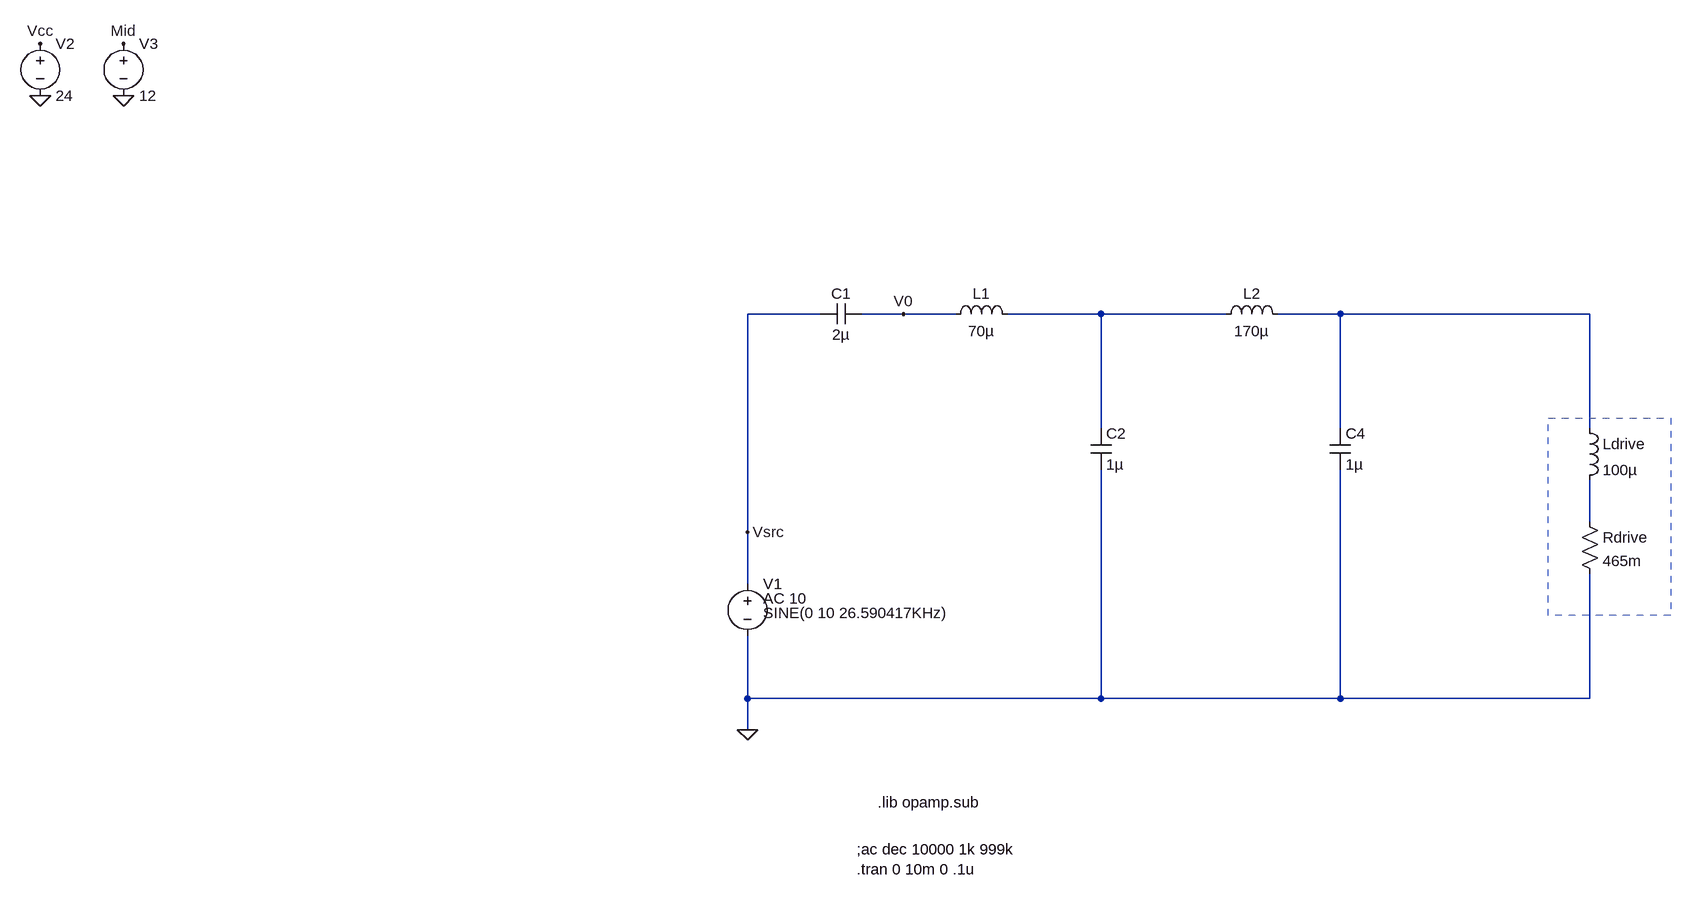
[diagram p0: schematic Tx_Filter_MPSv2_v2-WithOpAmp.asc]
Tx_Filter_MPSv2_v2-WithOpAmp.asc, the LTspice schematic file:
Version 4
SHEET 1 2128 1188
WIRE 656 64 544 64
WIRE 784 64 720 64
WIRE 864 64 784 64
WIRE 1088 64 944 64
WIRE 1280 64 1088 64
WIRE 1456 64 1360 64
WIRE 1840 64 1456 64
WIRE 1088 240 1088 64
WIRE 1456 240 1456 64
WIRE 1840 240 1840 64
WIRE 1840 384 1840 320
WIRE 544 400 544 64
WIRE 544 480 544 400
WIRE 544 656 544 560
WIRE 1088 656 1088 304
WIRE 1088 656 544 656
WIRE 1456 656 1456 304
WIRE 1456 656 1088 656
WIRE 1840 656 1840 464
WIRE 1840 656 1456 656
WIRE 544 704 544 656
FLAG 544 400 Vsrc
FLAG 784 64 V0
FLAG 544 704 0
FLAG -544 -272 0
FLAG -544 -352 Vcc
FLAG -416 -272 0
FLAG -416 -352 Mid
SYMBOL voltage 544 464 R0
WINDOW 123 24 38 Left 2
WINDOW 3 24 60 Left 2
WINDOW 39 0 0 Left 0
SYMATTR Value2 AC 10
SYMATTR Value SINE(0 10 26.590417KHz)
SYMATTR InstName V1
SYMBOL res 1824 368 R0
SYMATTR InstName Rdrive
SYMATTR Value 465m
SYMBOL ind 1824 224 R0
SYMATTR InstName Ldrive
SYMATTR Value 100µ
SYMBOL ind 848 80 R270
WINDOW 0 32 56 VTop 2
WINDOW 3 5 56 VBottom 2
SYMATTR InstName L1
SYMATTR Value 70µ
SYMATTR SpiceLine Rser=.1472
SYMBOL ind 1264 80 R270
WINDOW 0 32 56 VTop 2
WINDOW 3 5 56 VBottom 2
SYMATTR InstName L2
SYMATTR Value 170µ
SYMATTR SpiceLine Rser=.2
SYMBOL cap 720 48 R90
WINDOW 0 0 32 VBottom 2
WINDOW 3 32 32 VTop 2
SYMATTR InstName C1
SYMATTR Value 2µ
SYMBOL cap 1072 240 R0
SYMATTR InstName C2
SYMATTR Value 1µ
SYMBOL cap 1440 240 R0
SYMATTR InstName C4
SYMATTR Value 1µ
SYMBOL voltage -544 -368 R0
WINDOW 123 0 0 Left 0
WINDOW 39 0 0 Left 0
SYMATTR InstName V2
SYMATTR Value 24
SYMBOL voltage -416 -368 R0
WINDOW 123 0 0 Left 0
WINDOW 39 0 0 Left 0
SYMATTR InstName V3
SYMATTR Value 12
TEXT 712 888 Left 2 !;ac dec 10000 1k 999k\n.tran 0 10m 0 .1u
TEXT 744 816 Left 2 !.lib opamp.sub
RECTANGLE Normal 1776 224 1964 528 2

The netlist it stands for:
* Tx_Filter_MPSv2_v2-WithOpAmp.asc
V1 Vsrc 0 SINE(0 10 26.590417KHz) AC 10
Rdrive N003 0 465m
Ldrive N002 N003 100µ
L1 V0 N001 70µ Rser=.1472
L2 N001 N002 170µ Rser=.2
C1 V0 Vsrc 2µ
C2 N001 0 1µ
C4 N002 0 1µ
V2 Vcc 0 24
V3 Mid 0 12
;ac dec 10000 1k 999k
.tran 0 10m 0 .1u
.lib opamp.sub
.backanno
.end